# EAGLE design touchy_feely (EAGLE 6.4)
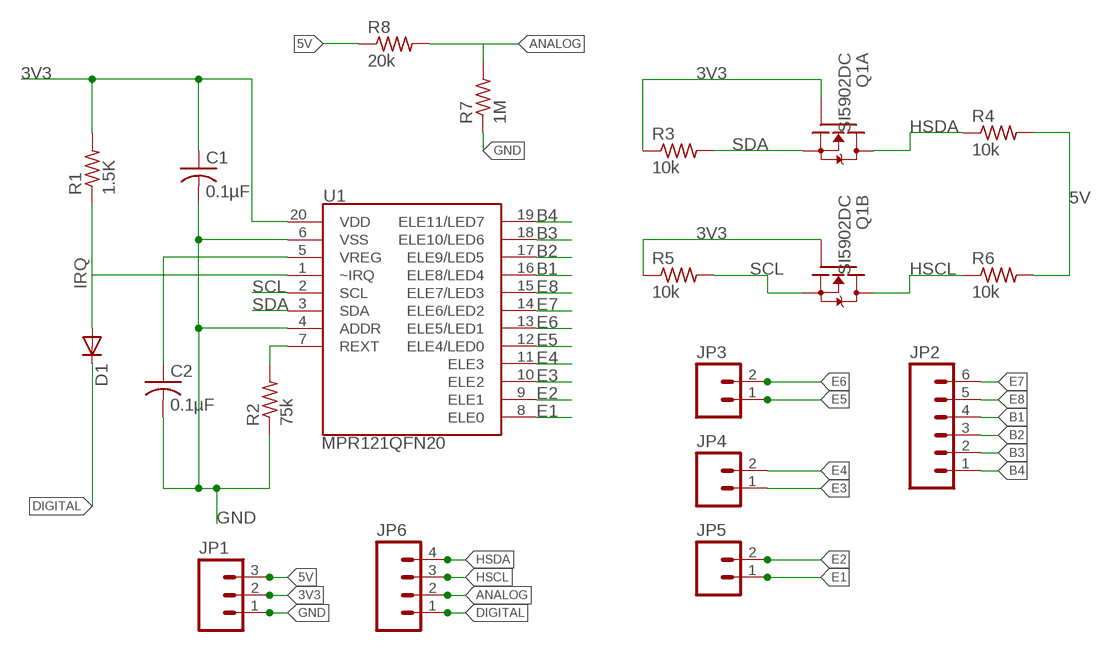
[diagram p0: schematic, sheet 1]

## Parts
C1  0.1µF  C-USC0603K  [C0603K]
C2  0.1µF  C-USC0603K  [C0603K]
D1  DIODE-MINIMELF  [MINIMELF]
JP1  M03PTH  [1X03]
JP2  M06SIP  [1X06]
JP3  M023.5MM  [SCREWTERMINAL-3.5MM-2]
JP4  M023.5MM  [SCREWTERMINAL-3.5MM-2]
JP5  M023.5MM  [SCREWTERMINAL-3.5MM-2]
JP6  M04PTH  [1X04]
Q1  SI5902DC  [1206-8CHIP-FET]
R1  1.5K  R-US_M0805  [M0805]
R2  75k  R-US_M0805  [M0805]
R3  10k  R-US_M0805  [M0805]
R4  10k  R-US_M0805  [M0805]
R5  10k  R-US_M0805  [M0805]
R6  10k  R-US_M0805  [M0805]
R7  1M  R-US_R0805  [R0805]
R8  20k  R-US_R0805  [R0805]
U1  MPR121QFN20  [QFN-20-0.4MM]

## Nets
3V3: C1.1 JP1.2 Q1.2(A:G) Q1.4(B:G) R1.2 R3.1 R5.1 U1.20(VDD)
5V: JP1.3 R4.2 R6.2 R8.1
ANALOG: JP6.2 R7.2 R8.2
B1: JP2.4 U1.16(ELE8/LED4)
B2: JP2.3 U1.17(ELE9/LED5)
B3: JP2.2 U1.18(ELE10/LED6)
B4: JP2.1 U1.19(ELE11/LED7)
DIGITAL: D1.C JP6.1
E1: JP5.1 U1.8(ELE0)
E2: JP5.2 U1.9(ELE1)
E3: JP4.1 U1.10(ELE2)
E4: JP4.2 U1.11(ELE3)
E5: JP3.1 U1.12(ELE4/LED0)
E6: JP3.2 U1.13(ELE5/LED1)
E7: JP2.6 U1.14(ELE6/LED2)
E8: JP2.5 U1.15(ELE7/LED3)
GND: C1.2 C2.2 JP1.1 R2.1 R7.1 U1.4(ADDR) U1.6(VSS)
HSCL: JP6.3 Q1.5(B:D) Q1.6(B:D) R6.1
HSDA: JP6.4 Q1.7(A:D) Q1.8(A:D) R4.1
IRQ: D1.A R1.1 U1.1(~IRQ)
N$2: C2.1 U1.5(VREG)
N$3: R2.2 U1.7(REXT)
SCL: Q1.3(B:S) R5.2 U1.2(SCL)
SDA: Q1.1(A:S) R3.2 U1.3(SDA)

## Library data of the parts
C1 C2 = rcl:C-US: CAPACITOR, American symbol
D1 = diode:DIODE-: DIODE
JP1 = SparkFun:M03: Header 3 Standard 3-pin 0.1" header. Use with straight break away headers (SKU : PRT-00116), right angle break away headers (PRT-00553), swiss pins (PRT-00743), machine pins (PRT-00117), and female headers (PRT-00115). Molex polarized connector foot print use with SKU : PRT-08232 with associated crimp pins and housings.
JP2 = SparkFun:M06: Header 6 Standard 6-pin 0.1" header. Use with straight break away headers (SKU : PRT-00116), right angle break away headers (PRT-00553), swiss pins (PRT-00743), machine pins (PRT-00117), and female headers (PRT-00115). Molex polarized connector foot print use with SKU : PRT-08094 with associated crimp pins and housings. NOTES ON THE VARIANTS LOCK and LOCK_LONGPADS... This footprint was designed to help hold the alignment of a through-hole component (i.e. 6-pin header) while soldering it into place. You may notice that each hole has been shifted either up or down by 0.005 of an inch from it's more standard position (which is a perfectly straight line). This slight alteration caused the pins (the squares in the middle) to touch the edges of the holes. Because they are alternating, it causes a "brace" to hold the component in place. 0.005 has proven to be the perfect amount of "off-center" position when using our standard breakaway headers. Although looks a little odd when you look at the bare footprint, once you have a header in there, the alteration is very hard to notice. Also, if you push a header all the way into place, it is covered up entirely on the bottom side. This idea of altering the position of holes to aid alignment will be further integrated into the Sparkfun Library for other footprints. It can help hold any component with 3 or more connection pins.
JP3-JP5 = SparkFun:M02: Header 2 Standard 2-pin 0.1" header. Use with straight break away headers (SKU : PRT-00116), right angle break away headers (PRT-00553), swiss pins (PRT-00743), machine pins (PRT-00117), and female headers (PRT-00115). Molex polarized connector foot print use with SKU : PRT-08233 with associated crimp pins and housings.
JP6 = SparkFun:M04: Header 4 Standard 4-pin 0.1" header. Use with straight break away headers (SKU : PRT-00116), right angle break away headers (PRT-00553), swiss pins (PRT-00743), machine pins (PRT-00117), and female headers (PRT-00115). Molex polarized connector foot print use with SKU : PRT-08231 with associated crimp pins and housings. 1MM SMD Version SKU: PRT-10208
Q1 = transistor-fet:SI5902DC: Dual N-Channel 30-V (D-S) MOSFET Source: http://www.vishay.com/docs/71053/71053.pdf
R1-R6 = resistor:R-US_: RESISTOR, American symbol
R7 R8 = rcl:R-US_: RESISTOR, American symbol
U1 = SparkFun:MPR121: MPR121 Capacitive Touch Sensor Controller

## Board
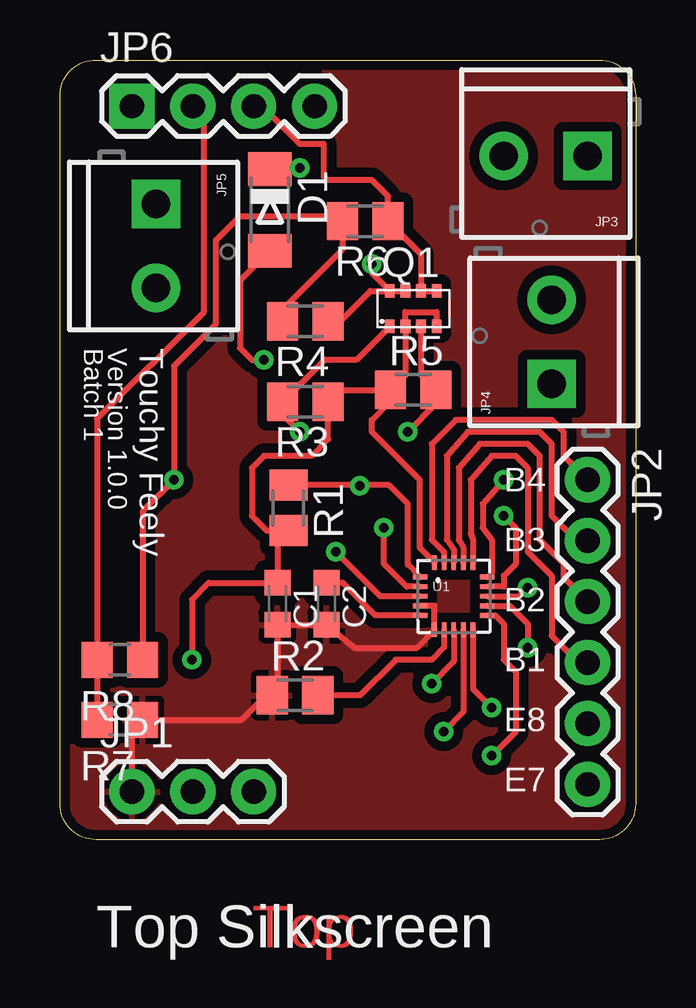
[diagram p1: board, top side]
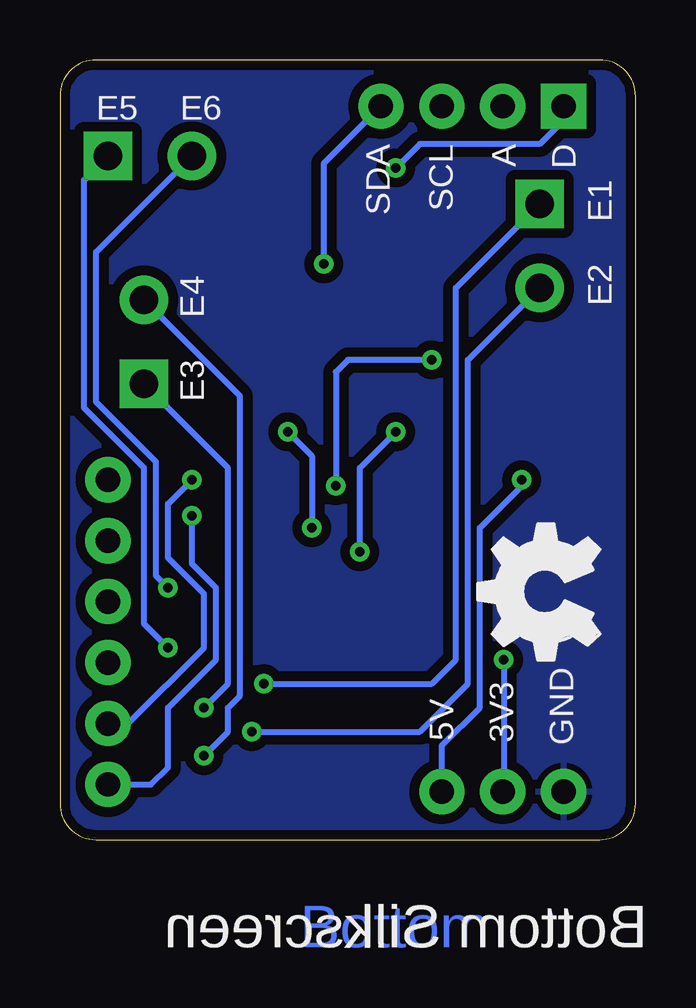
[diagram p2: board, bottom side, seen from below]

Size 24 x 32.5 mm. Coordinates in mm from the lower left corner, seen from the top.
Outline: 22.5,32.5 arc-90 24,31 24,1.5 arc-90 22.5,0 1.5,0 arc-90 0,1.5 0,31 arc-90 1.5,32.5 22.5,32.5
Copper layers (1*16): Top 0.035mm / dielectric 1.5mm / Bottom 0.035mm
Design rules "default *": minimum track width 10mil, minimum drill 0.5mm, track to track 5mil, track to pad 5mil, pad to pad 3mil, via to via 8mil, smd to smd 3mil, copper to edge 10mil, drill to drill 8mil, minimum pad ring 10mil, minimum via ring 8mil, stop-mask expansion 4mil, vias tented up to drill 0.5mm, thermal gap 10mil

### Footprints (pad centres in the part's own frame; a part is rotated, then mirrored left to right if it is on the bottom)
C0603K = smd 1.05 x 1.08: 1 -0.875,0; 2 0.875,0
MINIMELF = smd 1.4 x 1.8: A 1.7,0; C -1.7,0
1X03 = drill 1.016 pad 1.88: 1 0,0; 2 2.54,0; 3 5.08,0
1X06 = drill 1.016 pad 1.88: 1 0,0; 2 2.54,0; 3 5.08,0; 4 7.62,0; 5 10.16,0; 6 12.7,0
SCREWTERMINAL-3.5MM-2 = drill 1.2 pad 2.032 square: 1 0,0 | drill 1.2 pad 2.032: 2 3.5,0
1X04 = drill 1.016 pad 1.88 square: 1 0,0 | drill 1.016 pad 1.88: 2 2.54,0; 3 5.08,0; 4 7.62,0
1206-8CHIP-FET = smd 0.406 x 0.56: 1 -0.975,-0.737; 2 -0.325,-0.737; 3 0.325,-0.737; 4 0.975,-0.737; 5 0.975,0.737; 6 0.325,0.737; 7 -0.325,0.737; 8 -0.975,0.737
M0805 = smd 1.3 x 1.6: 1 -0.95,0; 2 0.95,0
R0805 = smd 1.3 x 1.5: 1 -0.95,0; 2 0.95,0
QFN-20-0.4MM = smd 0.6 x 0.2: 1 -1.4,0.8; 2 -1.4,0.4; 3 -1.4,0; 4 -1.4,-0.4; 5 -1.4,-0.8; 11 1.4,-0.8; 12 1.4,-0.4; 13 1.4,0; 14 1.4,0.4; 15 1.4,0.8 | smd 0.2 x 0.6: 6 -0.8,-1.4; 7 -0.4,-1.4; 8 0,-1.4; 9 0.4,-1.4; 10 0.8,-1.4; 16 0.8,1.4; 17 0.4,1.4; 18 0,1.4; 19 -0.4,1.4; 20 -0.8,1.4

### Placement (x,y rotation side)
C1  9.07,9.83 270 top
C2  11.11,9.83 270 top
D1  8.75,26.25 270 top
JP1  3,2 0 top
JP2  22,15 270 top
JP3  22,28.5 180 top
JP4  20.5,19 90 top
JP5  4,26.5 270 top
JP6  3,30.57 0 top
Q1  14.73,22.13 0 top
R1  9.53,13.83 270 top
R2  9.8,6.02 0 top
R3  10.23,18.25 180 top
R4  10.23,21.6 180 top
R5  14.73,18.75 0 top
R6  12.73,25.78 180 top
R7  2.5,5 180 top
R8  2.5,7.5 180 top
U1  16.42,10.14 0 top
U$2  [OSHW_FILLX200_NOTEXT]  1.5,7.5 90 bottom

### Tracks (layer width: path | path; a pad name or v marks a point on that pad's centre or on a via)
3V3  (via drill 0.4)
  Top 0.254: R5.1 14.4,19.38 Q1.2 14.4,22 15.71,22 Q1.4 | R3.1 11,18.57 | U1.20 15,12.16 15,15 13,17 13,17.5 13.78,18.28 R5.1 | v5.5,7.5 5.5,10 6.21,10.71 C1.1 9.07,12.42 R1.2 8.62,12.88 8,13.5 8,15.5 8.5,16 10.5,16 11.18,16.68 R3.1 | R3.1 11.68,18.75 R5.1
  Bottom 0.254: v5.5,7.5 5.5,2.04 JP1.2
5V  (via drill 0.4)
  Top 0.254: R8.1 3.45,13.7 v4.75,15 4.75,19.75 6.5,21.5 6.5,25 7.5,26 11.56,26 R6.2 11.78,24.6 9.28,22.1 R4.2
  Bottom 0.254: JP1.3 8.08,3.92 6.5,5.5 6.5,13 4.5,15 v4.75,15
ANALOG
  Top 0.254: JP6.2 6,30.11 6,22 1.55,17.55 R8.2 R7.2
B1
  Top 0.254: JP2.4 21.62,7.38 20.5,8.5 20.5,11 19.5,12 19.5,15.5 19,16 18,16 17.12,15 17.12,12.75 17.22,12.48 U1.16
B2
  Top 0.254: JP2.3 21,10.92 21,11.5 20,12.5 20,16 19.5,16.5 17.5,16.5 16.62,15.5 16.62,12.5 16.82,12.18 U1.17
B3
  Top 0.254: JP2.2 21.54,12.46 20.5,13.5 20.5,16.5 20,17 17,17 16.12,16 16.12,12.5 16.42,12.08 U1.18
B4
  Top 0.254: JP2.1 21,16 21,17 20.5,17.5 16.5,17.5 15.5,16.5 15.5,12.5 16.02,11.98 U1.19
DIGITAL  (via drill 0.4)
  Top 0.254: D1.C 9.95,27.95 v10,28
  Bottom 0.254: JP6.1 3,30 4,29 9,29 v10,28
E1  (via drill 0.4)
  Top 0.254: U1.8 16.42,7.42 v15.5,6.5
  Bottom 0.254: JP5.1 7.5,23 7.5,7.5 8.5,6.5 v15.5,6.5
E2  (via drill 0.4)
  Top 0.254: U1.9 16.82,5.32 v16,4.5
  Bottom 0.254: JP5.2 7,20 7,6.5 9,4.5 v16,4.5
E3  (via drill 0.4)
  Top 0.254: U1.10 17.22,6.28 v18,5.5
  Bottom 0.254: v18,5.5 17,6.5 17,15.5 JP4.1
E4  (via drill 0.4)
  Top 0.254: U1.11 18.16,9.35 18.5,9 18.5,7.5 19,7 19,4.5 v18,3.5
  Bottom 0.254: v18,3.5 17,4.5 17,5.5 16.5,6 16.5,18.5 JP4.2
E5  (via drill 0.4)
  Top 0.254: U1.12 18.75,9.74 19.5,9 v19.5,8
  Bottom 0.254: v19.5,8 20.5,9 20.5,15.5 23,18 23,27.5 JP3.1
E6  (via drill 0.4)
  Top 0.254: U1.13 19.14,10.14 v19.5,10.5
  Bottom 0.254: v19.5,10.5 20,11 20,15.75 22.5,18.25 22.5,24.5 JP3.2
E7  (via drill 0.4)
  Top 0.254: U1.14 17.86,10.55 18.5,10.55 18.5,11 19,11.5 19,13 v18.5,13.5
  Bottom 0.254: JP2.6 20.2,2.3 19.5,3 19.5,5.5 17.5,7.5 17.5,10.5 18.5,11.5 v18.5,13.5
E8  (via drill 0.4)
  Top 0.254: 17.95,10.95 U1.15 18,11.12 18,12.5 17.62,13 17.62,14 v18.5,15
  Bottom 0.254: JP2.5 21.16,4.84 18,8 18,10.25 19.5,11.75 19.5,14 v18.5,15
GND
  Top 0.254: 9.07,6.5 C1.2 C2.2 12.29,8 14.88,8 U1.6 15.62,9.74 U1.4 | 9.07,6.5 9.07,6.24 R2.1 8.32,6.55 | JP1.1 3,4.55 R7.1 7.57,5 9.07,6.5
  pour Top (isolate 0.406): 0.5,33 -1,33 -1,-0.5 25,-0.5 25,33
  pour Bottom (isolate 0.406): -1,33 -1,-0.5 25,-0.5 25,33
HSCL
  Top 0.254: Q1.5 Q1.6 15.05,24.41 R6.1 13.68,26.82 13,27.5 11.15,27.5 11,27.66 11,29 10,29 8.43,30.57 JP6.3
HSDA  (via drill 0.4)
  Top 0.254: Q1.8 12.95,22.87 11.68,21.6 R4.1 | Q1.8 13,23.62 v13,24 | Q1.8 Q1.7
  Bottom 0.254: v13,24 13,28.2 JP6.4
IRQ  (via drill 0.4)
  Top 0.254: U1.1 14.5,11.46 14.5,14 13.72,14.78 12.5,14.78 | 12.5,14.78 R1.1 | D1.A 7.5,23.3 7.5,20.5 8,20 v8.5,20 | 12.5,14.78 v12.5,14.75
  Bottom 0.254: v8.5,20 12,20 12.5,19.5 v12.5,14.75
N$2
  Top 0.254: U1.5 13.15,9.35 11.79,10.71 C2.1
N$3
  Top 0.254: U1.7 16.02,8.02 15.5,7.5 14,7.5 12.52,6.02 R2.2
SCL  (via drill 0.4)
  Top 0.254: Q1.3 15.05,19.38 R5.2 15.68,18.18 v14.5,17 | U1.2 14.46,10.54 13.5,11.5 v13.5,13
  Bottom 0.254: v14.5,17 13.5,16 v13.5,13
SDA  (via drill 0.4)
  Top 0.254: Q1.1 12.36,20 11.03,20 R3.2 9.28,17.72 v10,17 | U1.3 13.36,10.14 v11.5,12
  Bottom 0.254: v11.5,12 11.5,15.5 v10,17

### Text on the board
Top: Top
Bottom: Bottom
tStop: Top Solder Stop Mask
bStop: Bottom Solder Stop Mask
tCream: Top Paste Mask
Drills: Drills
tDesignators: R6 | D1 | Q1 | R4 | R5 | R3 | R1 | U1 | C1 | C2 | R8 | R2 | R7 | SMT Designators
tSilkLabel: Batch 1 | Version 1.0.0 | Touchy Feely | B4 | B3 | B2 | B1 | E8 | E7 | Top Silkscreen
bSilkLabel: E6 | E5 | D | A | SCL | SDA | E1 | E2 | E4 | E3 | GND | 3V3 | 5V | Bottom Silkscreen